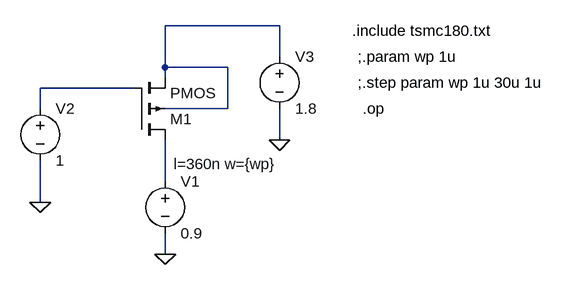
[diagram p0: schematic pmos_swift.asc]
pmos_swift.asc, the LTspice schematic file:
Version 4
SHEET 1 880 680
WIRE 336 16 160 16
WIRE 336 64 336 16
WIRE 160 80 160 16
WIRE 256 80 160 80
WIRE 160 96 160 80
WIRE 112 112 -32 112
WIRE -32 144 -32 112
WIRE 256 144 256 80
WIRE 256 144 160 144
WIRE 336 192 336 144
WIRE 160 256 160 192
WIRE -32 288 -32 224
WIRE 160 368 160 336
FLAG -32 288 0
FLAG 160 368 0
FLAG 336 192 0
SYMBOL pmos4 112 192 M180
WINDOW 123 61 -37 Left 2
SYMATTR InstName M1
SYMATTR Value2 l=360n w={wp}
SYMBOL voltage 160 240 R0
SYMATTR InstName V1
SYMATTR Value 0.9
SYMBOL voltage -32 128 R0
SYMATTR InstName V2
SYMATTR Value 1
SYMBOL voltage 336 48 R0
SYMATTR InstName V3
SYMATTR Value 1.8
TEXT 448 24 Left 2 !.include tsmc180.txt
TEXT 456 64 Left 2 !;.param wp 1u
TEXT 456 104 Left 2 !;.step param wp 1u 30u 1u
TEXT 464 144 Left 2 !.op

The netlist it stands for:
* pmos_swift.asc
M1 N003 N002 N001 N001 PMOS l=360n w={wp}
V1 N003 0 0.9
V2 N002 0 1
V3 N001 0 1.8
.model NMOS NMOS
.model PMOS PMOS
.lib standard.mos
.include tsmc180.txt
;.param wp 1u
;.step param wp 1u 30u 1u
.op
.backanno
.end